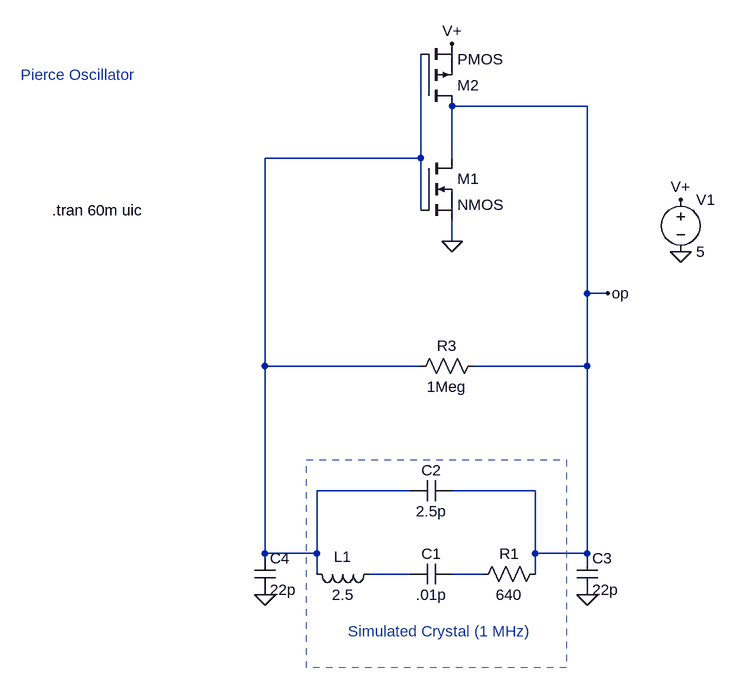
[diagram p0: schematic Pierce_Oscillator.asc]
Pierce_Oscillator.asc, the LTspice schematic file:
Version 4.1
SHEET 1 3048 2472
WIRE 2272 1424 2064 1424
WIRE 2016 1504 2016 1344
WIRE 2016 1504 1776 1504
WIRE 2064 1504 2064 1424
WIRE 2016 1584 2016 1504
WIRE 2064 1632 2064 1600
WIRE 2272 1712 2272 1424
WIRE 2304 1712 2272 1712
WIRE 1776 1824 1776 1504
WIRE 2016 1824 1776 1824
WIRE 2272 1824 2272 1712
WIRE 2272 1824 2096 1824
WIRE 2000 2016 1856 2016
WIRE 2192 2016 2064 2016
WIRE 1776 2112 1776 1824
WIRE 1856 2112 1856 2016
WIRE 1856 2112 1776 2112
WIRE 2192 2112 2192 2016
WIRE 2272 2112 2272 1824
WIRE 2272 2112 2192 2112
WIRE 1856 2144 1856 2112
WIRE 2000 2144 1936 2144
WIRE 2112 2144 2064 2144
WIRE 2192 2144 2192 2112
FLAG 1776 2176 0
FLAG 2272 2176 0
FLAG 2416 1648 0
FLAG 2416 1568 V+
FLAG 2304 1712 op
FLAG 2064 1328 V+
FLAG 2064 1632 0
SYMBOL ind 1952 2128 R90
WINDOW 0 5 56 VBottom 2
WINDOW 3 32 56 VTop 2
SYMATTR InstName L1
SYMATTR Value 2.5
SYMBOL cap 2064 2128 R90
WINDOW 0 0 32 VBottom 2
WINDOW 3 32 32 VTop 2
SYMATTR InstName C1
SYMATTR Value .01p
SYMBOL res 2208 2128 R90
WINDOW 0 0 56 VBottom 2
WINDOW 3 32 56 VTop 2
SYMATTR InstName R1
SYMATTR Value 640
SYMBOL cap 2064 2000 R90
WINDOW 0 0 32 VBottom 2
WINDOW 3 32 32 VTop 2
SYMATTR InstName C2
SYMATTR Value 2.5p
SYMBOL cap 2256 2112 R0
SYMATTR InstName C3
SYMATTR Value 22p
SYMBOL cap 1760 2112 R0
SYMATTR InstName C4
SYMATTR Value 22p
SYMBOL res 2112 1808 R90
WINDOW 0 0 56 VBottom 2
WINDOW 3 32 56 VTop 2
SYMATTR InstName R3
SYMATTR Value 1Meg
SYMBOL voltage 2416 1552 R0
WINDOW 123 0 0 Left 0
WINDOW 39 0 0 Left 0
SYMATTR InstName V1
SYMATTR Value 5
SYMBOL nmos 2016 1504 R0
SYMATTR InstName M1
SYMBOL pmos 2016 1424 M180
SYMATTR InstName M2
TEXT 1448 1584 Left 2 !.tran 60m uic
TEXT 1904 2232 Left 2 ;Simulated Crystal (1 MHz)
TEXT 1400 1376 Left 2 ;Pierce Oscillator
RECTANGLE Normal 2240 2288 1840 1968 2

The netlist it stands for:
* Pierce_Oscillator.asc
L1 N002 N001 2.5
C1 N003 N002 .01p
R1 op N003 640
C2 op N001 2.5p
C3 op 0 22p
C4 N001 0 22p
R3 op N001 1Meg
V1 V+ 0 5
M1 op N001 0 0 NMOS
M2 op N001 V+ V+ PMOS
.model NMOS NMOS
.model PMOS PMOS
.lib standard.mos
.tran 60m uic
* Simulated Crystal (1 MHz)
* Pierce Oscillator
.backanno
.end